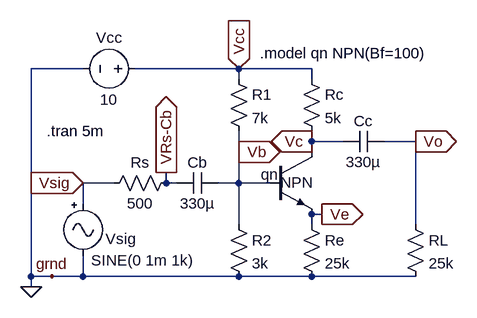
[diagram p0: schematic Q1b.asc]
Q1b.asc, the LTspice schematic file:
Version 4
SHEET 1 880 680
WIRE -656 -256 -736 -256
WIRE -416 -256 -576 -256
WIRE -304 -256 -416 -256
WIRE -416 -240 -416 -256
WIRE -304 -240 -304 -256
WIRE -304 -144 -304 -160
WIRE -256 -144 -304 -144
WIRE -144 -144 -192 -144
WIRE -416 -128 -416 -160
WIRE -304 -128 -304 -144
WIRE -608 -80 -656 -80
WIRE -528 -80 -528 -96
WIRE -512 -80 -528 -80
WIRE -416 -80 -416 -128
WIRE -416 -80 -448 -80
WIRE -368 -80 -416 -80
WIRE -656 -48 -656 -80
WIRE -288 -32 -304 -32
WIRE -416 -16 -416 -80
WIRE -304 -16 -304 -32
WIRE -144 -16 -144 -144
WIRE -736 64 -736 -256
WIRE -704 64 -736 64
WIRE -656 64 -656 32
WIRE -656 64 -704 64
WIRE -416 64 -656 64
WIRE -304 64 -416 64
WIRE -144 64 -304 64
WIRE -736 80 -736 64
FLAG -736 80 0
FLAG -416 -256 Vcc
IOPIN -416 -256 In
FLAG -528 -96 VRs-Cb
IOPIN -528 -96 Out
FLAG -656 -80 Vsig
IOPIN -656 -80 In
FLAG -416 -128 Vb
IOPIN -416 -128 Out
FLAG -304 -144 Vc
IOPIN -304 -144 Out
FLAG -288 -32 Ve
IOPIN -288 -32 Out
FLAG -704 64 grnd
FLAG -144 -144 Vo
IOPIN -144 -144 Out
SYMBOL voltage -560 -256 R90
WINDOW 0 -32 56 VBottom 2
WINDOW 3 32 56 VTop 2
SYMATTR InstName Vcc
SYMATTR Value 10
SYMBOL res -320 -256 R0
SYMATTR InstName Rc
SYMATTR Value 5k
SYMBOL res -432 -256 R0
SYMATTR InstName R1
SYMATTR Value 7k
SYMBOL cap -192 -160 R90
WINDOW 0 0 32 VBottom 2
WINDOW 3 32 32 VTop 2
SYMATTR InstName Cc
SYMATTR Value 330µ
SYMBOL cap -448 -96 R90
WINDOW 0 0 32 VBottom 2
WINDOW 3 32 32 VTop 2
SYMATTR InstName Cb
SYMATTR Value 330µ
SYMBOL res -624 -64 R270
WINDOW 0 32 56 VTop 2
WINDOW 3 0 56 VBottom 2
SYMATTR InstName Rs
SYMATTR Value 500
SYMBOL res -432 -32 R0
SYMATTR InstName R2
SYMATTR Value 3k
SYMBOL res -320 -32 R0
SYMATTR InstName Re
SYMATTR Value 25k
SYMBOL res -160 -32 R0
SYMATTR InstName RL
SYMATTR Value 25k
SYMBOL npn -368 -128 R0
WINDOW 0 -14 35 Left 2
WINDOW 3 16 47 Left 2
SYMATTR InstName qn
SYMBOL signal -656 -64 R0
WINDOW 0 35 70 Left 2
WINDOW 3 12 103 Left 2
WINDOW 123 0 0 Left 2
WINDOW 39 0 0 Left 2
SYMATTR InstName Vsig
SYMATTR Value SINE(0 1m 1k)
TEXT -384 -280 Left 2 !.model qn NPN(Bf=100)
TEXT -712 -160 Left 2 !.tran 5m

The netlist it stands for:
* Q1b.asc
Vcc Vcc 0 10
Rc Vcc Vc 5k
R1 Vcc Vb 7k
Cc Vo Vc 330µ
Cb Vb VRs-Cb 330µ
Rs Vsig VRs-Cb 500
R2 Vb 0 3k
Re Ve 0 25k
RL Vo 0 25k
qn Vc Vb Ve 0 NPN
Vsig Vsig 0 SINE(0 1m 1k)
.model NPN NPN
.model PNP PNP
.lib standard.bjt
.model qn NPN(Bf=100)
.tran 5m
.backanno
.end